# Altium schematic sheet uMultimeter_PWR_Sch.SchDoc: MicroMultimeter - PWR
size 127 x 101 mm; Author: Hom; CompanyName: KitSprout; DrawnBy: Hom; Engineer: Hom; Organization: KitSprout; Revision: B; SheetNumber: 1; SheetTotal: 1; License: CC BY-SA 4.0; Version: 2.0; LibVersion: 2.1; PageSetup: Record=PageOptions|CenterHorizontal=True|CenterVertical=True|PrintScale=1.00|XCorrection=1.00|YCorrection=1.00|PrintKind=0|BorderSize=5000000|LeftOffset=0|BottomOffset=0|Orientation=2|PaperLength=1000|PaperWidth=1000|Scale=100|PaperSource=7|PrintQuality=-3|MediaType=1|DitherType=10|PrintScaleMode=0|PaperKind=A4|PaperIndex=9
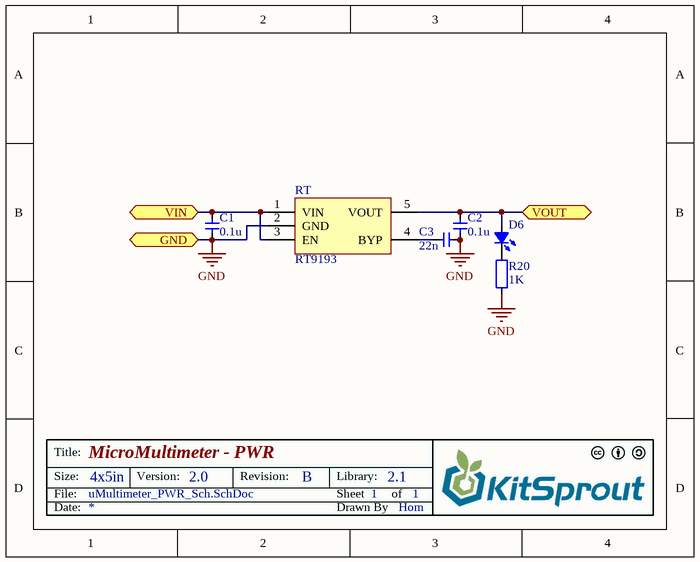
[diagram p0: uMultimeter_PWR_Sch.SchDoc]

## Parts
C1  value 0.1u  [CAP_0603]  (hidden comment: Cap_0603)
C2  value 0.1u  [CAP_0603]  (hidden comment: Cap_0603)
C3  value 22n  [CAP_0603]  (hidden comment: Cap_0603)
D6  LED_0805  [LED_0805_ORANGE]  (value not drawn)
R20  value 1K  [RES_0603]  (hidden comment: Res_0603)
RT  RT9193  [SOT23-5]

## Ports
GND, VIN, VOUT

## Nets
GND: C1.1 C2.1 C3.1 R20.2 RT.2(GND) ; port GND
VIN: C1.2 RT.1(VIN) RT.3(EN) ; port VIN
VOUT: C2.2 D6.1(A) RT.5(VOUT) ; port VOUT
NetC3_2: C3.2 RT.4(BYP)
NetD6_2: D6.2(K) R20.1

## Notes on the sheet
- Title:
- Size:
- Date:
- File:
- 4x5in
- Version:
- Revision:
- Sheet
- Drawn By
- Library:
- of

## Library data of the parts
C1-C3 = Cap_0603: Capacitor
D6 = LED_0805: LED
R20 = Res_0603: Resistor
RT = SP6205: Power